# Altium schematic sheet EEPROM_ID.SchDoc
size A4; SheetNumber: 3; SheetTotal: 3
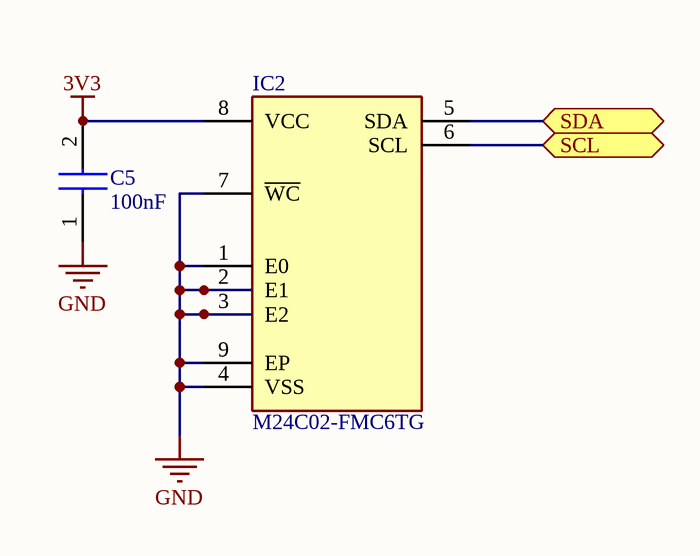
[diagram p0: EEPROM_ID.SchDoc]

## Parts
C5  100nF  [CAPC1005X70N]
IC2  M24C02-FMC6TG  [M24C02FMC6TG]

## Ports
SCL (bidir, see main[2B], WIO_E5[1C]), SDA (bidir, see main[2B], WIO_E5[1C])

## Nets
3V3: C5.2 IC2.8(VCC)
GND: C5.1 IC2.1(E0) IC2.2(E1) IC2.3(E2) IC2.4(VSS) IC2.7(~{WC}) IC2.9(EP)
SCL: IC2.6(SCL) ; port SCL
SDA: IC2.5(SDA) ; port SDA

## Notes on the sheet
- Title:
- Date:
- Project:
- Type:
- Schematic
- Variant:
- Revision:
- Sheet
- of
- Author:
- Evžen Šteif
- Size:
- A4

## Library data of the parts
C5 = GRM155R61A104KA01D: Capacitor; Manufacturer_Name: Murata Electronics; Datasheet Link: https://search.murata.co.jp/Ceramy/image/img/A01X/G101/ENG/GRM155R61A104KA01-02A.pdf; Height: 0.7mm; Manufacturer_Part_Number: GRM155R61A104KA01D; Mouser Part Number: 81-GRM155R61A104KA01; Mouser Price/Stock: https://www.mouser.co.uk/ProductDetail/Murata-Electronics/GRM155R61A104KA01D?qs=5bAuhL3RhmNZw0v59AqOJA%3D%3D; Arrow Part Number: GRM155R61A104KA01D; Arrow Price/Stock: https://www.arrow.com/en/products/grm155r61a104ka01d/murata-manufacturing?utm_currency=USD&region=europe
IC2 = M24C02-FMC6TG: Integrated Circuit; Manufacturer_Name: STMicroelectronics; Datasheet Link: https://www.st.com/resource/en/datasheet/m24c01-r.pdf; Height: 0.6mm; Manufacturer_Part_Number: M24C02-FMC6TG; Mouser Part Number: 511-M24C02-FMC6TG; Mouser Price/Stock: https://www.mouser.co.uk/ProductDetail/STMicroelectronics/M24C02-FMC6TG?qs=WHlX%252B%252B9%2FRwB%252BxJ8bQxWbzQ%3D%3D; Arrow Part Number: M24C02-FMC6TG; Arrow Price/Stock: https://www.arrow.com/en/products/m24c02-fmc6tg/stmicroelectronics?region=nac